# EAGLE design quad.exp.vca.pnl (EAGLE 7.5.0)
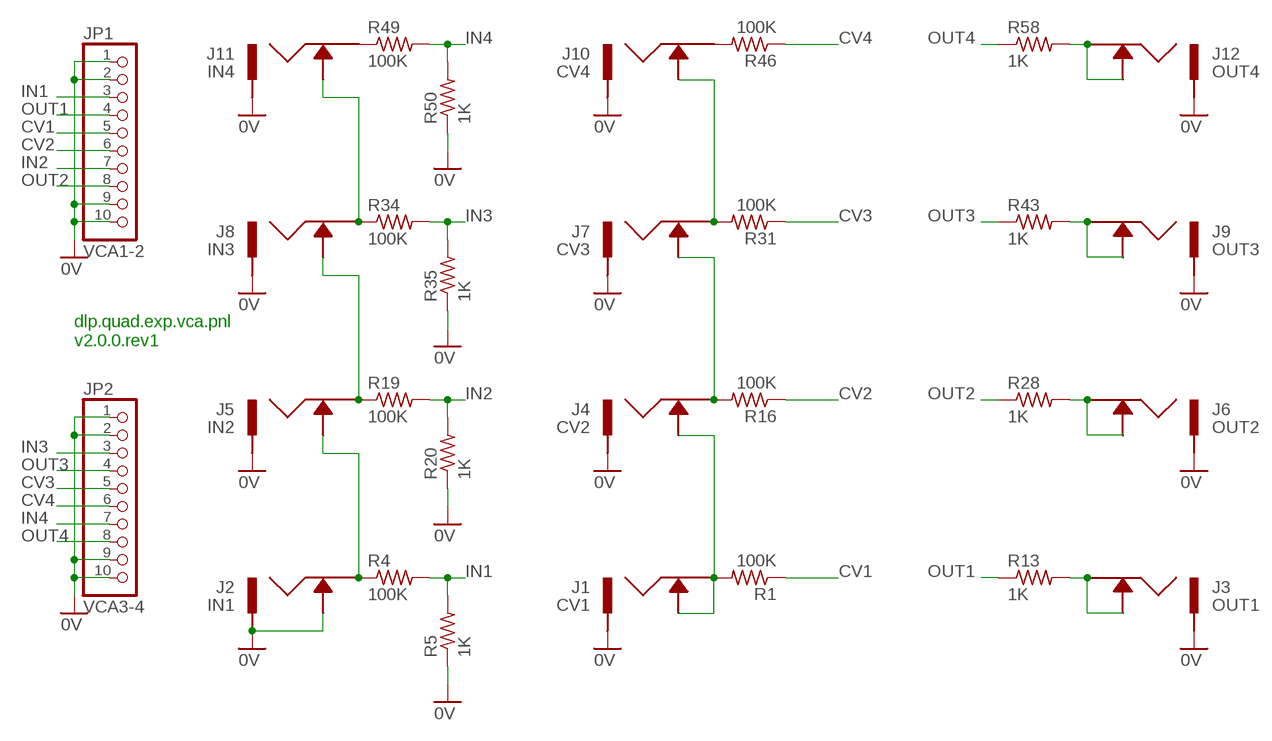
[diagram p0: schematic, sheet 1]

## Parts
J1  CV1  ACJM-MV35-2S  [ACJM-MV35-2S]
J2  IN1  ACJM-MV35-2S  [ACJM-MV35-2S]
J3  OUT1  ACJM-MV35-2S  [ACJM-MV35-2S]
J4  CV2  ACJM-MV35-2S  [ACJM-MV35-2S]
J5  IN2  ACJM-MV35-2S  [ACJM-MV35-2S]
J6  OUT2  ACJM-MV35-2S  [ACJM-MV35-2S]
J7  CV3  ACJM-MV35-2S  [ACJM-MV35-2S]
J8  IN3  ACJM-MV35-2S  [ACJM-MV35-2S]
J9  OUT3  ACJM-MV35-2S  [ACJM-MV35-2S]
J10  CV4  ACJM-MV35-2S  [ACJM-MV35-2S]
J11  IN4  ACJM-MV35-2S  [ACJM-MV35-2S]
J12  OUT4  ACJM-MV35-2S  [ACJM-MV35-2S]
JP1  VCA1-2  PINHD-1X10  [1X10]
JP2  VCA3-4  PINHD-1X10  [1X10]
R1  100K  R-US_0207/7  [0207/7]
R4  100K  R-US_0207/7  [0207/7]
R5  1K  R-US_0207/7  [0207/7]
R13  1K  R-US_0207/7  [0207/7]
R16  100K  R-US_0207/7  [0207/7]
R19  100K  R-US_0207/7  [0207/7]
R20  1K  R-US_0207/7  [0207/7]
R28  1K  R-US_0207/7  [0207/7]
R31  100K  R-US_0207/7  [0207/7]
R34  100K  R-US_0207/7  [0207/7]
R35  1K  R-US_0207/7  [0207/7]
R43  1K  R-US_0207/7  [0207/7]
R46  100K  R-US_0207/7  [0207/7]
R49  100K  R-US_0207/7  [0207/7]
R50  1K  R-US_0207/7  [0207/7]
R58  1K  R-US_0207/7  [0207/7]

## Nets
0V: J1.P$1 J2.P$1 J2.P$2 J3.P$1 J4.P$1 J5.P$1 J6.P$1 J7.P$1 J8.P$1 J9.P$1 J10.P$1 J11.P$1 J12.P$1 JP1.1 JP1.2 JP1.9 JP1.10 JP2.1 JP2.2 JP2.9 JP2.10 R5.1 R20.1 R35.1 R50.1
CV1: JP1.5 R1.1
CV2: JP1.6 R16.1
CV3: JP2.5 R31.1
CV4: JP2.6 R46.1
IN1: JP1.3 R4.2 R5.2
IN2: JP1.7 R19.2 R20.2
IN3: JP2.3 R34.2 R35.2
IN4: JP2.7 R49.2 R50.2
N$1: J9.P$2 J9.P$3 R43.2
N$2: J3.P$2 J3.P$3 R13.2
N$3: J2.P$3 J5.P$2 R4.1
N$4: J5.P$3 J8.P$2 R19.1
N$5: J8.P$3 J11.P$2 R34.1
N$6: J10.P$3 R46.2
N$7: J7.P$3 J10.P$2 R31.2
N$8: J4.P$3 J7.P$2 R16.2
N$16: J1.P$2 J1.P$3 J4.P$2 R1.2
N$24: J6.P$2 J6.P$3 R28.2
N$31: J12.P$2 J12.P$3 R58.2
N$42: J11.P$3 R49.1
OUT1: JP1.4 R13.1
OUT2: JP1.8 R28.1
OUT3: JP2.4 R43.1
OUT4: JP2.8 R58.1

## Notes on the sheet
- dlp.quad.exp.vca.pnl
  v2.0.0.rev1

## Library data of the parts
J1-J12 = jacks:ACJM-MV35-2S: Amphenol 3.5mm Jack (Vertical) ACJM-MV35-2S http://ca.mouser.com/Search/ProductDetail.aspx?R=ACJM-MV35-2Svirtualkey52380000virtualkey523-ACJMMV352S
JP1 JP2 = pinhead:PINHD-1X10: PIN HEADER
R1 R4 R5 R13 R16 R19 R20 R28 R31 R34 R35 R43 R46 R49 R50 R58 = resistor:R-US_: RESISTOR, American symbol

## Board
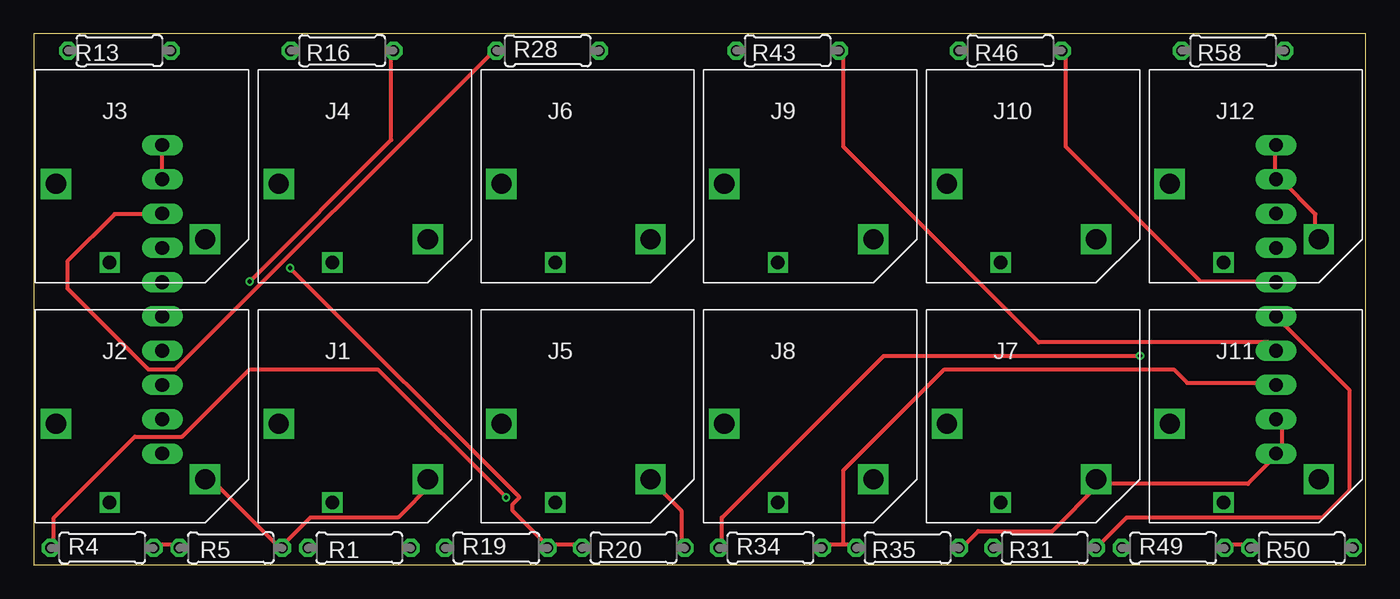
[diagram p1: board, top side]
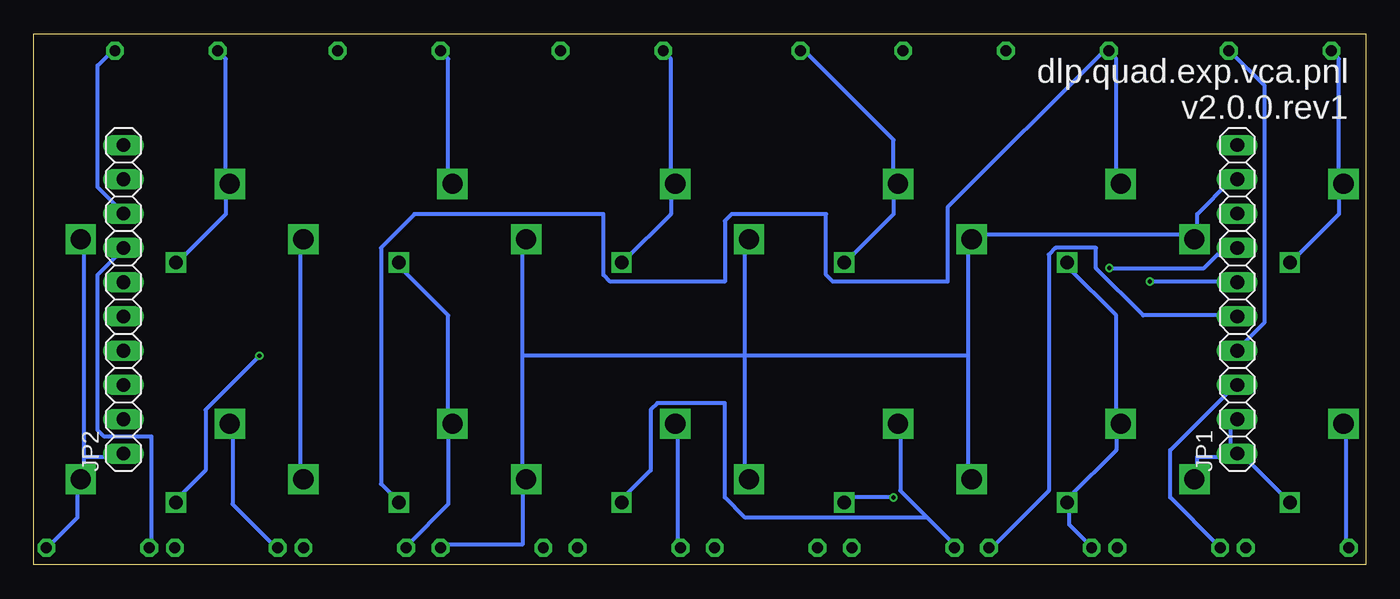
[diagram p2: board, bottom side, seen from below]

Size 98.73 x 39.36 mm. Coordinates in mm from the lower left corner, seen from the top.
Outline: 0,0 98.73,0 98.73,39.36 0,39.36 0,0
Copper layers (1*16): Top 0.035mm / dielectric 1.5mm / Bottom 0.035mm
Design rules "SeeedStudio_2layer_DRU_no_angle_20140221 *": minimum track width 12mil, minimum drill 12mil, track to track 6mil, track to pad 6mil, pad to pad 6mil, via to via 6mil, smd to smd 0mil, copper to edge 10mil, drill to drill 10mil, minimum pad ring 10mil, minimum via ring 6mil, stop-mask expansion 2mil, vias tented up to drill 100mil, thermal gap 10mil

### Footprints (pad centres in the part's own frame; a part is rotated, then mirrored left to right if it is on the bottom)
ACJM-MV35-2S = drill 1.5 square: P$1 0,0; P$3 -11.05,4.11 | drill 1 square: P$2 -7.07,-1.71
1X10 = drill 1.016 long: 1 -11.43,0; 2 -8.89,0; 3 -6.35,0; 4 -3.81,0; 5 -1.27,0; 6 1.27,0; 7 3.81,0; 8 6.35,0; 9 8.89,0; 10 11.43,0
0207/7 = drill 0.813 octagon: 1 -3.81,0; 2 3.81,0

### Placement (x,y rotation side)
J1  29.21,6.35 0 top
J2  12.7,6.35 0 top
J3  12.7,24.13 0 top
J4  29.21,24.13 0 top
J5  45.72,6.35 0 top
J6  45.72,24.13 0 top
J7  78.74,6.35 0 top
J8  62.23,6.35 0 top
J9  62.23,24.13 0 top
J10  78.74,24.13 0 top
J11  95.25,6.35 0 top
J12  95.25,24.13 0 top
JP1  9.53,19.68 90 bottom
JP2  92.08,19.68 90 bottom
R1  24.13,1.27 180 top
R4  5.08,1.27 0 top
R5  14.61,1.27 180 top
R13  6.35,38.1 180 top
R16  22.86,38.1 180 top
R19  34.29,1.27 0 top
R20  44.45,1.27 180 top
R28  38.1,38.1 0 top
R31  74.93,1.27 180 top
R34  54.61,1.27 0 top
R35  64.77,1.27 180 top
R43  55.88,38.1 180 top
R46  72.39,38.1 180 top
R49  84.45,1.27 0 top
R50  93.98,1.27 180 top
R58  88.9,38.1 180 top

### Tracks (layer width: path | path; a pad name or v marks a point on that pad's centre or on a via)
0V
  Top 0.305: JP2.10 92,31 92,29 JP2.9 92.5,28.5 95,26 95,24.5 J12.P$1 | JP2.2 92.5,10.5 92.5,8.5 JP2.1 92,8 90,6 79,6 | R20.1 48,1.5 48,4 46,6 J5.P$1 | J2.P$1 13,6 13.5,6 18,1.5 R5.1 18.5,1.5 20.5,3.5 27,3.5 29.5,6 J1.P$1 | JP1.9 9.5,29 9.5,31 JP1.10 | 79,6 75.5,2.5 70,2.5 69,1.5 R35.1 | 79,6 J7.P$1
  Bottom 0.305: J7.P$1 79,6.5 79,24 J10.P$1 | R50.1 97.5,1.5 95.5,3.5 95.5,6 J11.P$1 95,6.5 95,8 | 95,8 92.5,8 JP2.1 | 95,8 95,24 J12.P$1 | R35.1 68.5,1.5 62.5,1.5 62.5,6 J8.P$1 62.5,6.5 62.5,15.5 | 62.5,15.5 62.5,24 J9.P$1 | 46,15.5 46,6.5 J5.P$1 | 46,15.5 46,24 J6.P$1 | J2.P$2 6,5 9.5,8.5 JP1.1 | JP1.2 10,10.5 10,8.5 JP1.1 | JP1.1 10,8 12.5,8 12.5,6.5 J2.P$1 | JP1.9 10,28.5 12.5,26 12.5,24.5 J3.P$1 13,24.5 29,24.5 J4.P$1 29.5,24 29.5,15.5 | 29.5,15.5 29.5,6.5 J1.P$1 | 29.5,15.5 46,15.5 | 46,15.5 62.5,15.5
CV1
  Bottom 0.305: R1.1 27.5,1.5 23.5,5.5 23.5,23 23,23.5 20,23.5 20,22 16.5,18.5 10,18.5 JP1.5
CV2  (via drill 0.3)
  Top 0.305: v16,21 26.5,31.5 26.5,38 R16.1
  Bottom 0.305: v16,21 10,21 JP1.6
CV3
  Top 0.305: R31.1 79,1.5 81,3.5 95.5,3.5 97.5,5.5 97.5,13 92.5,18 JP2.5
CV4
  Top 0.305: R46.1 76.5,38 76.5,31 86.5,21 92,21 JP2.6
IN1
  Top 0.305: R4.2 9,1.5 10.5,1.5 R5.2
  Bottom 0.305: JP1.3 10,13 14.5,8.5 14.5,5 11,1.5 R5.2
IN2  (via drill 0.3)
  Top 0.305: R20.2 40.5,1.5 38.5,1.5 R19.2 38,1.5 35.5,4 35.5,4.5 36,5 v19,22
  Bottom 0.305: v19,22 12,22 11,23 10,23 JP1.7
IN3
  Top 0.305: 60,1.5 60.5,1.5 R35.2 | 60,1.5 58.5,1.5 R34.2 | 60,1.5 60,7 67.5,14.5 84.5,14.5 85.5,13.5 92,13.5 JP2.3
IN4
  Top 0.305: R49.2 88.5,1.5 90,1.5 R50.2
  Bottom 0.305: JP2.7 92.5,23 94,21.5 94,10 93.5,9.5 90,9.5 90,1.5 R50.2
N$1
  Bottom 0.305: R43.2 52,38 51.5,37.5 51.5,28.5 J9.P$3 51.5,28 51.5,26 55,22.5 J9.P$2
N$2
  Bottom 0.305: R13.2 2.5,38 2,37.5 2,28.5 J3.P$3 2,28 2,26 5.5,22.5 J3.P$2
N$3  (via drill 0.3)
  Top 0.305: v35,5 25.5,14.5 16,14.5 11,9.5 7.5,9.5 1.5,3.5 1.5,1.5 R4.1
  Bottom 0.305: R4.1 1.5,1.5 1.5,10 J2.P$3 | v35,5 38.5,5 J5.P$2
N$4
  Bottom 0.305: 32.5,3.5 34.5,5.5 34.5,10 J5.P$3 | 32.5,3.5 30.5,1.5 R19.1 | 32.5,3.5 46,3.5 47.5,5 47.5,12 52.5,12 53,11.5 53,7 55,5 J8.P$2
N$5  (via drill 0.3)
  Top 0.305: v82,15.5 63,15.5 51,3.5 51,1.5 R34.1
  Bottom 0.305: R34.1 51,1.5 51,10 J8.P$3 | v82,15.5 86,11.5 86,7 88,5 J11.P$2
N$6
  Bottom 0.305: R46.2 68.5,38 68,37.5 68,28.5 J10.P$3
N$7
  Bottom 0.305: R31.2 71,1.5 68,4.5 68,10 J7.P$3 68,10.5 68,18.5 71.5,22 J10.P$2
N$8
  Bottom 0.305: J4.P$3 18.5,28.5 18.5,37.5 19,38 R16.2 19.5,38 31,26.5 31,21 39.5,21 40,21.5 40,26 47,26 47.5,25.5 47.5,21 56,21 56.5,21.5 56.5,26 70.5,26 73,23.5 73,6 72,5 J7.P$2
N$16
  Bottom 0.305: R1.2 20.5,1.5 22,3 22,4.5 J1.P$2 22,5 18.5,8.5 18.5,10 J1.P$3 18.5,10.5 18.5,18.5 22,22 J4.P$2
N$24
  Bottom 0.305: R28.2 41.5,38 35,31.5 35,28.5 J6.P$3 35,28 35,26 38.5,22.5 J6.P$2
N$31
  Bottom 0.305: R58.2 85,38 84.5,37.5 84.5,28.5 J12.P$3 84.5,28 84.5,26 88,22.5 J12.P$2
N$42
  Bottom 0.305: R49.1 81,1.5 84,4.5 84,10 J11.P$3
OUT1
  Bottom 0.305: R13.1 10,38 7.5,35.5 7.5,18 9.5,16 JP1.4
OUT2
  Top 0.305: R28.1 34,38 10.5,14.5 8.5,14.5 2.5,20.5 2.5,22.5 6,26 9.5,26 JP1.8
OUT3
  Top 0.305: R43.1 60,38 60,31 74.5,16.5 91.5,16.5 92,16 JP2.4
OUT4
  Bottom 0.305: R58.1 93,38 94,37 94,28 92.5,26.5 JP2.8

### Text on the board
bNames: dlp.quad.exp.vca.pnl / v2.0.0.rev1